# EAGLE design TNY-NROM-02 (EAGLE 9.6.2)
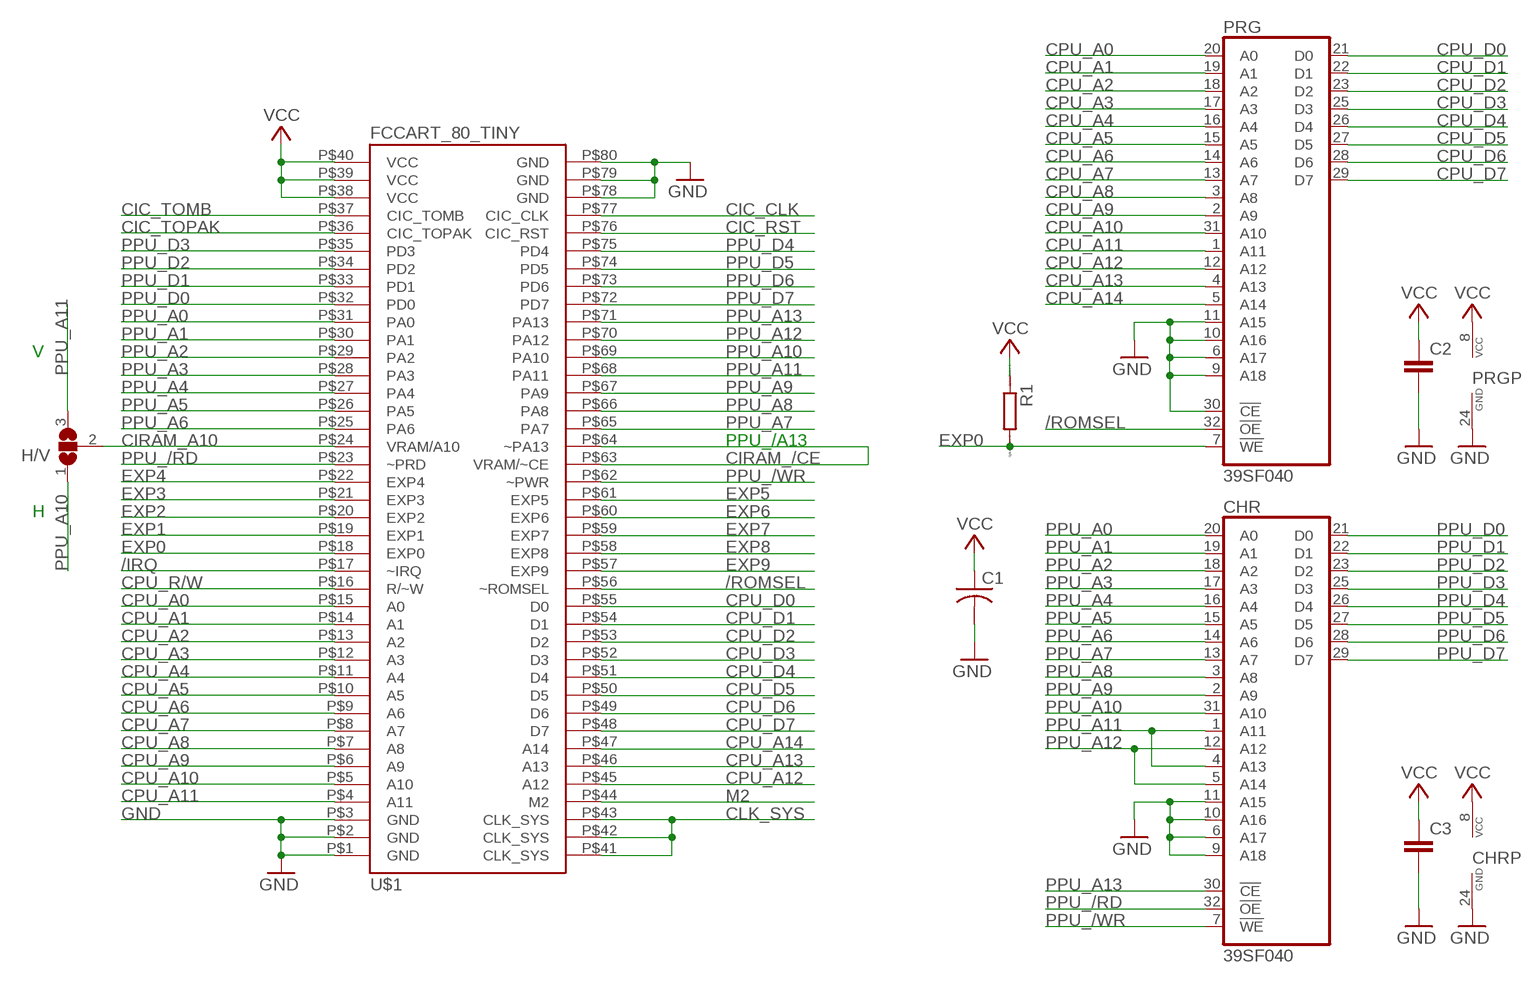
[diagram p0: schematic, sheet 1]

## Parts
C1  C-USC1206  [C1206]
C2  C-EUC0603K  [C0603K]
C3  C-EUC0603K  [C0603K]
CHR  39SF040  AM29F040ESHORT  [TSOP32_SHORT]
H/V  SJ2W  [SJ_2]
PRG  39SF040  AM29F040ESHORT  [TSOP32_SHORT]
R1  RR0603  [R0603]
U$1  FCCART_80_TINY  [FCCART_80_TINY]

## Nets
/IRQ: U$1.P$17(~IRQ)
/ROMSEL: PRG.32(!OE) U$1.P$56(~ROMSEL)
CIC_CLK: U$1.P$77(CIC_CLK)
CIC_RST: U$1.P$76(CIC_RST)
CIC_TOMB: U$1.P$37(CIC_TOMB)
CIC_TOPAK: U$1.P$36(CIC_TOPAK)
CIRAM_/CE: U$1.P$63(VRAM/~CE) U$1.P$64(~PA13)
CIRAM_A10: H/V.2 U$1.P$24(VRAM/A10)
CLK_SYS: U$1.P$41(CLK_SYS) U$1.P$42(CLK_SYS) U$1.P$43(CLK_SYS)
CPU_A0: PRG.20(A0) U$1.P$15(A0)
CPU_A1: PRG.19(A1) U$1.P$14(A1)
CPU_A2: PRG.18(A2) U$1.P$13(A2)
CPU_A3: PRG.17(A3) U$1.P$12(A3)
CPU_A4: PRG.16(A4) U$1.P$11(A4)
CPU_A5: PRG.15(A5) U$1.P$10(A5)
CPU_A6: PRG.14(A6) U$1.P$9(A6)
CPU_A7: PRG.13(A7) U$1.P$8(A7)
CPU_A8: PRG.3(A8) U$1.P$7(A8)
CPU_A9: PRG.2(A9) U$1.P$6(A9)
CPU_A10: PRG.31(A10) U$1.P$5(A10)
CPU_A11: PRG.1(A11) U$1.P$4(A11)
CPU_A12: PRG.12(A12) U$1.P$45(A12)
CPU_A13: PRG.4(A13) U$1.P$46(A13)
CPU_A14: PRG.5(A14) U$1.P$47(A14)
CPU_D0: PRG.21(D0) U$1.P$55(D0)
CPU_D1: PRG.22(D1) U$1.P$54(D1)
CPU_D2: PRG.23(D2) U$1.P$53(D2)
CPU_D3: PRG.25(D3) U$1.P$52(D3)
CPU_D4: PRG.26(D4) U$1.P$51(D4)
CPU_D5: PRG.27(D5) U$1.P$50(D5)
CPU_D6: PRG.28(D6) U$1.P$49(D6)
CPU_D7: PRG.29(D7) U$1.P$48(D7)
CPU_R/W: U$1.P$16(R/~W)
EXP0: PRG.7(!WE) R1.2 U$1.P$18(EXP0)
EXP1: U$1.P$19(EXP1)
EXP2: U$1.P$20(EXP2)
EXP3: U$1.P$21(EXP3)
EXP4: U$1.P$22(EXP4)
EXP5: U$1.P$61(EXP5)
EXP6: U$1.P$60(EXP6)
EXP7: U$1.P$59(EXP7)
EXP8: U$1.P$58(EXP8)
EXP9: U$1.P$57(EXP9)
GND: C1.2 C2.2 C3.2 CHR.6(A17) CHR.9(A18) CHR.10(A16) CHR.11(A15) CHR.24(GND) PRG.6(A17) PRG.9(A18) PRG.10(A16) PRG.11(A15) PRG.24(GND) PRG.30(!CE) U$1.P$1(GND) U$1.P$2(GND) U$1.P$3(GND) U$1.P$78(GND) U$1.P$79(GND) U$1.P$80(GND)
M2: U$1.P$44(M2)
PPU_/RD: CHR.32(!OE) U$1.P$23(~PRD)
PPU_/WR: CHR.7(!WE) U$1.P$62(~PWR)
PPU_A0: CHR.20(A0) U$1.P$31(PA0)
PPU_A1: CHR.19(A1) U$1.P$30(PA1)
PPU_A2: CHR.18(A2) U$1.P$29(PA2)
PPU_A3: CHR.17(A3) U$1.P$28(PA3)
PPU_A4: CHR.16(A4) U$1.P$27(PA4)
PPU_A5: CHR.15(A5) U$1.P$26(PA5)
PPU_A6: CHR.14(A6) U$1.P$25(PA6)
PPU_A7: CHR.13(A7) U$1.P$65(PA7)
PPU_A8: CHR.3(A8) U$1.P$66(PA8)
PPU_A9: CHR.2(A9) U$1.P$67(PA9)
PPU_A10: CHR.31(A10) H/V.1 U$1.P$69(PA10)
PPU_A11: CHR.1(A11) CHR.4(A13) H/V.3 U$1.P$68(PA11)
PPU_A12: CHR.5(A14) CHR.12(A12) U$1.P$70(PA12)
PPU_A13: CHR.30(!CE) U$1.P$71(PA13)
PPU_D0: CHR.21(D0) U$1.P$32(PD0)
PPU_D1: CHR.22(D1) U$1.P$33(PD1)
PPU_D2: CHR.23(D2) U$1.P$34(PD2)
PPU_D3: CHR.25(D3) U$1.P$35(PD3)
PPU_D4: CHR.26(D4) U$1.P$75(PD4)
PPU_D5: CHR.27(D5) U$1.P$74(PD5)
PPU_D6: CHR.28(D6) U$1.P$73(PD6)
PPU_D7: CHR.29(D7) U$1.P$72(PD7)
VCC: C1.1 C2.1 C3.1 CHR.8(VCC) PRG.8(VCC) R1.1 U$1.P$38(VCC) U$1.P$39(VCC) U$1.P$40(VCC)

## Notes on the sheet
- V
- PPU_/A13
- H

## Library data of the parts
C1 = rcl:C-US: CAPACITOR, American symbol
C2 C3 = rcl:C-EU: CAPACITOR, European symbol
CHR PRG = am29-memory:AM29F040E: 4-Megabit FLASH MEMORY (512 K x 8 bit) 5 V-only
H/V = jumper:SJ2W: SMD solder JUMPER
R1 = eagle-ltspice:R: RESISTOR, European symbol; SPICEMODEL: NONE; SPICEPREFIX: R
U$1 = FC_connector_2:FCCART_80_TINY

## Board
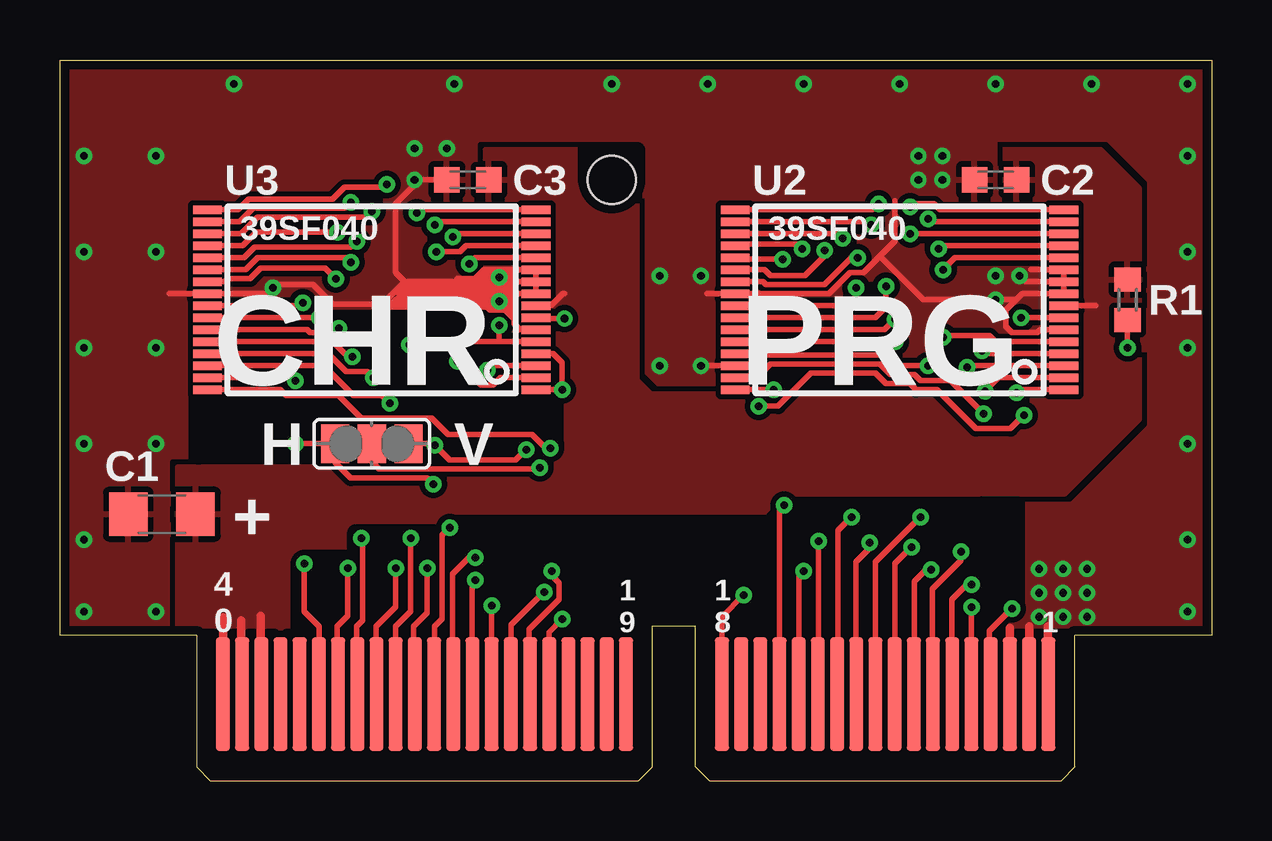
[diagram p1: board, top side]
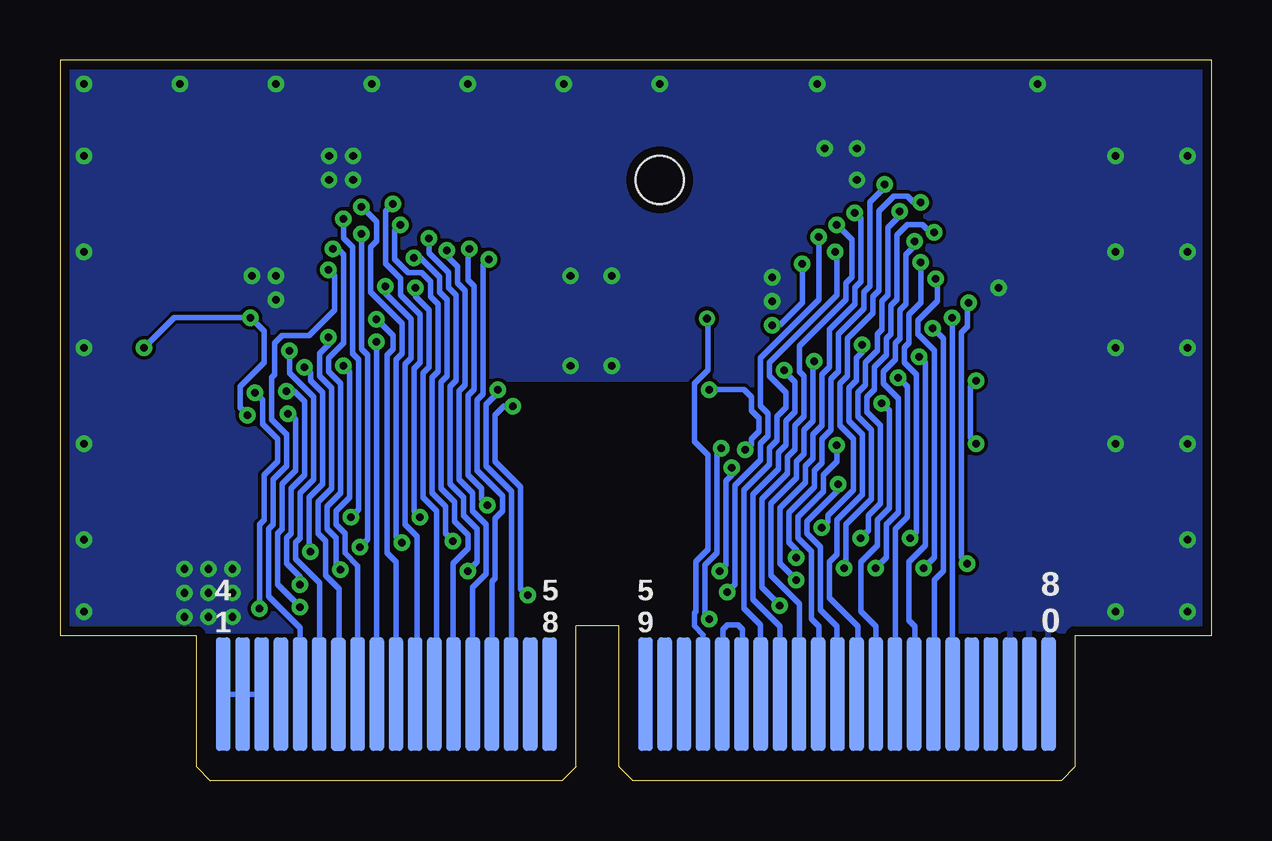
[diagram p2: board, bottom side, seen from below]

Size 48 x 30.05 mm. Coordinates in mm from the lower left corner, seen from the top.
Copper layers (1*16): Top 0.0356mm / dielectric 1.5011mm / Bottom 0.0356mm
Design rules "jlcpcb *": minimum track width 6mil, minimum drill 13mil, track to track 6mil, track to pad 5mil, pad to pad 5mil, via to via 6mil, smd to smd 5mil, copper to edge 15mil, drill to drill 22mil, minimum pad ring 7mil, minimum via ring 7mil, stop-mask expansion 2.5mil, vias tented up to drill 13mil, thermal gap 10mil
Holes 2 mm at 23,25.05
tRestrict: area 20,14.1 to 20.7,16.1; area 21.9,24.9 to 24.1,26.3; area 11.4,18.7 to 17.8,20.5; area 5.7,13.5 to 5.9,16.1; area 38.4,7.1 to 39.9,11.5; area 16.2,10.5 to 29.6,10.8; area 10.2,8.6 to 15.8,10.4; area 9.9,6.1 to 10.6,9
bRestrict: area 20,15.1 to 30.1,16.5

### Footprints (pad centres in the part's own frame; a part is rotated, then mirrored left to right if it is on the bottom)
C1206 = smd 1.6 x 1.8: 1 -1.4,0; 2 1.4,0
C0603K = smd 1.05 x 1.08: 1 -0.875,0; 2 0.875,0
TSOP32_SHORT = smd 0.36 x 1.2: 1 -3.75,-9.85; 2 -3.25,-9.85; 3 -2.75,-9.85; 4 -2.25,-9.85; 5 -1.75,-9.85; 6 -1.25,-9.85; 7 -0.75,-9.85; 8 -0.25,-9.85; 9 0.25,-9.85; 10 0.75,-9.85; 11 1.25,-9.85; 12 1.75,-9.85; 13 2.25,-9.85; 14 2.75,-9.85; 15 3.25,-9.85; 16 3.75,-9.85; 17 3.75,3.85; 18 3.25,3.85; 19 2.75,3.85; 20 2.25,3.85; 21 1.75,3.85; 22 1.25,3.85; 23 0.75,3.85; 24 0.25,3.85; 25 -0.25,3.85; 26 -0.75,3.85; 27 -1.25,3.85; 28 -1.75,3.85; 29 -2.25,3.85; 30 -2.75,3.85; 31 -3.25,3.85; 32 -3.75,3.85
SJ_2 = smd 1.168 x 1.6: 1 -1.524,0; 2 0,0; 3 1.524,0
R0603 = smd 1 x 1.1: 1 -0.85,0; 2 0.85,0
FCCART_80_TINY = smd 0.6 x 4.75: P$1 35.871,3.71; P$2 35.068,3.71; P$3 34.268,3.71; P$4 33.468,3.71; P$5 32.668,3.71; P$6 31.868,3.71; P$7 31.063,3.71; P$8 30.268,3.71; P$9 29.468,3.71; P$10 28.668,3.71; P$11 27.868,3.71; P$12 27.068,3.71; P$13 26.263,3.71; P$14 25.468,3.71; P$15 24.663,3.71; P$16 23.868,3.71; P$17 23.068,3.71; P$18 22.268,3.71; P$19 18.268,3.71; P$20 17.468,3.71; P$21 16.668,3.71; P$22 15.868,3.71; P$23 15.068,3.71; P$24 14.268,3.71; P$25 13.468,3.71; P$26 12.668,3.71; P$27 11.868,3.71; P$28 11.068,3.71; P$29 10.268,3.71; P$30 9.468,3.71; P$31 8.668,3.71; P$32 7.868,3.71; P$33 7.068,3.71; P$34 6.268,3.71; P$35 5.468,3.71; P$36 4.668,3.71; P$37 3.868,3.71; P$38 3.068,3.71; P$39 2.268,3.71; P$40 1.468,3.71 | smd 0.6 x 4.75 bottom: P$41 35.872,3.71; P$42 35.059,3.71; P$43 34.269,3.71; P$44 33.469,3.71; P$45 32.669,3.71; P$46 31.869,3.71; P$47 31.074,3.7; P$48 30.269,3.71; P$49 29.469,3.71; P$50 28.669,3.71; P$51 27.869,3.71; P$52 27.069,3.71; P$53 26.274,3.71; P$54 25.469,3.71; P$55 24.674,3.71; P$56 23.869,3.71; P$57 23.069,3.71; P$58 22.269,3.71; P$59 18.269,3.71; P$60 17.469,3.71; P$61 16.669,3.71; P$62 15.869,3.71; P$63 15.069,3.71; P$64 14.269,3.71; P$65 13.469,3.71; P$66 12.669,3.71; P$67 11.869,3.71; P$68 11.069,3.71; P$69 10.269,3.71; P$70 9.469,3.71; P$71 8.669,3.71; P$72 7.869,3.71; P$73 7.069,3.71; P$74 6.269,3.71; P$75 5.469,3.71; P$76 4.669,3.71; P$77 3.869,3.71; P$78 3.069,3.71; P$79 2.269,3.72; P$80 1.469,3.71

### Placement (x,y rotation side)
C1  4.25,11.11 180 top
C2  39,25.05 180 top
C3  17,25.05 180 top
CHR  10,20.05 90 top
H/V  13,14.05 0 top
PRG  32,20.05 90 top
R1  44.5,20.05 270 top
U$1  5.32,-0.1 0 top

### Tracks (layer width: path | path; a pad name or v marks a point on that pad's centre or on a via)
/ROMSEL  (via drill 0.33)
  Top 0.22: v29.75,16.3 PRG.32
  Bottom 0.22: U$1.P$56 29.19,12.05 30.25,13.11 30.25,15.68 29.75,16.18 v29.75,16.3
CIRAM_/CE
  Bottom 0.22: U$1.P$63 20.37,3.63 20.37,6.3 20.19,6.49 19.75,6.49 19.56,6.3 19.56,3.64 U$1.P$64
CIRAM_A10  (via drill 0.33)
  Top 0.22: H/V.2 13,13.3 13.31,12.99 19.94,12.99 v20,13.05 | U$1.P$24 19.56,3.64 19.56,6.3 20.81,7.55 20.81,8.24 20.5,8.55 v20.5,8.74
  Bottom 0.22: v20.5,8.74 20.25,8.99 20.25,12.49 20,12.74 v20,13.05
CLK_SYS
  Bottom 0.22: U$1.P$43 U$1.P$42 U$1.P$41
CPU_A0  (via drill 0.33)
  Top 0.22: U$1.P$15 30,11.3 v30.19,11.49 | v30.94,22.18 30.75,22.36 28.21,22.36 arc90 PRG.20
  Bottom 0.22: v30.19,11.49 30.44,11.74 30.44,12.18 31,12.74 31,16.05 30.75,16.3 30.75,20.61 31,20.86 31,21.99 30.94,22.05 v30.94,22.18
CPU_A1  (via drill 0.33)
  Top 0.22: 30.81,3.63 U$1.P$14 30.79,8.53 v31,8.74 | v32.62,22.61 32.44,22.8 PRG.19
  Bottom 0.22: v31,8.74 30.62,9.11 30.62,10.49 31.19,11.05 31.19,11.8 31.75,12.36 31.75,16.43 31.5,16.68 31.5,20.24 31.81,20.55 31.81,21.18 32.62,21.99 v32.62,22.61
CPU_A2  (via drill 0.33)
  Top 0.22: U$1.P$13 31.62,3.65 v31.62,9.99 | v33.81,23.18 33.69,23.3 PRG.18
  Bottom 0.22: v31.62,9.99 31.94,10.3 31.94,11.43 32.5,11.99 32.5,16.8 32.25,17.05 32.25,19.86 32.56,20.18 32.56,20.8 32.94,21.18 33.5,21.18 34.06,21.74 34.06,22.93 v33.81,23.18
CPU_A3  (via drill 0.33)
  Top 0.22: U$1.P$12 32.44,3.65 32.44,10.43 v33,10.99 | v34.12,24.05 33.87,23.8 PRG.17
  Bottom 0.22: v33,10.99 33.25,11.24 33.25,17.18 33,17.43 33,19.43 33.81,20.24 33.81,20.93 34.44,21.55 34.44,23.74 v34.12,24.05
CPU_A4  (via drill 0.33)
  Top 0.22: U$1.P$11 33.19,9.11 33.75,9.68 v33.75,9.93 | v35.44,23.93 35.56,24.05 36.44,24.05 36.69,23.8 PRG.16
  Bottom 0.22: v33.75,9.93 34,10.18 34,17.55 33.75,17.8 33.75,19.05 35.06,20.36 35.06,22.24 34.81,22.49 34.81,23.3 v35.44,23.93
CPU_A5  (via drill 0.33)
  Top 0.22: U$1.P$10 34,9.11 v35.87,10.99 | v36.19,23.43 36.31,23.3 PRG.15
  Bottom 0.22: v35.87,10.99 35.56,11.3 35.56,17.55 35.81,17.8 35.81,22.24 36.19,22.61 v36.19,23.43
CPU_A6  (via drill 0.33)
  Top 0.22: U$1.P$9 34.81,3.63 34.81,9.05 v35.5,9.74 | v35.44,22.8 PRG.14
  Bottom 0.22: v35.5,9.74 35.19,10.05 35.19,17.74 35.44,17.99 v35.44,22.8
CPU_A7  (via drill 0.33)
  Top 0.22: U$1.P$8 35.62,3.64 35.62,8.3 36.12,8.8 v36.31,8.8 | v36.62,22.18 36.75,22.3 PRG.13
  Bottom 0.22: v36.31,8.8 36.5,8.99 36.5,10.11 36.87,10.49 36.87,11.43 36.31,11.99 36.31,16.55 36.81,17.05 36.81,17.61 36.19,18.24 36.19,21.93 36.44,22.18 v36.62,22.18
CPU_A8  (via drill 0.33)
  Top 0.22: U$1.P$7 36.37,3.62 36.37,7.99 37.56,9.18 v37.56,9.55 | v37.81,17.24 37.87,17.3 PRG.3
  Bottom 0.22: v37.56,9.55 37.62,9.61 37.62,11.8 37.06,12.36 37.06,16.18 37.56,16.68 37.56,16.99 v37.81,17.24
CPU_A9  (via drill 0.33)
  Top 0.22: U$1.P$6 37.19,7.55 37.81,8.18 v38,8.18 | v38.56,16.24 39.12,16.8 PRG.2
  Bottom 0.22: v38.56,16.24 38.25,16.24 37.81,15.8 37.81,12.74 38.37,12.18 38.37,10.3 38.56,10.11 38.56,9.05 38,8.49 v38,8.18
CPU_A10  (via drill 0.33)
  Top 0.22: PRG.31 29.06,16.8 29.62,17.36 34.19,17.36 34.62,16.93 35.62,16.93 35.87,16.68 37.12,16.68 v38.5,15.3 | U$1.P$5 v38,7.24
  Bottom 0.22: v38,7.24 38.94,8.18 38.94,10.3 38.75,10.49 38.75,12.36 38.19,12.93 38.19,15.05 38.44,15.3 v38.5,15.3
CPU_A11  (via drill 0.33)
  Top 0.22: U$1.P$4 38.75,3.65 38.75,6.24 v39.69,7.18 | v39.87,16.18 40,16.3 PRG.1
  Bottom 0.22: v39.69,7.18 39.69,10.68 39.5,10.86 39.5,12.74 38.94,13.3 38.94,14.24 39.56,14.86 39.56,15.86 v39.87,16.18
CPU_A12  (via drill 0.33)
  Top 0.22: v36.81,21.3 37.31,21.8 PRG.12
  Bottom 0.22: U$1.P$45 38,6.36 39.31,7.68 39.31,10.49 39.12,10.68 39.12,12.55 38.56,13.11 38.56,14.43 39.19,15.05 39.19,16.8 39.06,16.93 39.06,18.24 38.75,18.55 37.62,18.55 36.56,19.61 36.56,21.05 v36.81,21.3
CPU_A13  (via drill 0.33)
  Top 0.22: v38.44,17.93 38.56,17.8 PRG.4
  Bottom 0.22: U$1.P$46 37.19,8.24 38.19,9.24 38.19,9.93 38,10.11 38,11.99 37.44,12.55 37.44,15.99 38.44,16.99 v38.44,17.93
CPU_A14  (via drill 0.33)
  Top 0.22: v36.81,18.49 36.87,18.55 38.75,18.55 39,18.3 PRG.5
  Bottom 0.22: U$1.P$47 36.37,3.62 36.37,7.99 36.94,8.55 36.94,9.99 37.25,10.3 37.25,11.61 36.69,12.18 36.69,16.36 37.19,16.86 37.19,17.8 36.81,18.18 v36.81,18.49
CPU_D0  (via drill 0.33)
  Top 0.22: PRG.21 28.21,21.74 v30.12,21.74
  Bottom 0.22: v30.12,21.74 30.37,21.49 30.37,16.11 30.62,15.86 30.62,12.93 29.56,11.86 29.56,11.24 29.87,10.93 29.87,8.43 30,8.3 U$1.P$55
CPU_D1  (via drill 0.33)
  Top 0.22: v31.87,22.11 31.87,21.86 31.06,21.05 29.62,21.05 29.37,21.3 PRG.22
  Bottom 0.22: U$1.P$54 30.81,3.63 30.81,8.05 30.25,8.61 30.25,10.68 30.81,11.24 30.81,11.99 31.37,12.55 31.37,16.24 31.12,16.49 31.12,20.43 31.44,20.74 31.44,21.43 31.87,21.86 v31.87,22.11
CPU_D2  (via drill 0.33)
  Top 0.22: v33.25,21.8 33,21.8 31.87,20.68 29.44,20.68 29.31,20.8 PRG.23
  Bottom 0.22: U$1.P$53 31.62,3.64 31.62,9.05 31,9.68 31,10.24 31.56,10.8 31.56,11.61 32.12,12.18 32.12,16.61 31.87,16.86 31.87,20.05 32.19,20.36 32.19,20.99 33,21.8 v33.25,21.8
CPU_D3  (via drill 0.33)
  Top 0.22: v33.19,20.55 33.19,20.18 32.81,19.8 PRG.25
  Bottom 0.22: U$1.P$52 32.31,3.78 32.31,11.24 32.87,11.8 32.87,16.99 32.62,17.24 32.62,19.61 33.19,20.18 v33.19,20.55
CPU_D4  (via drill 0.33)
  Top 0.22: PRG.26 34,19.3 34.44,19.74 v34.44,20.61
  Bottom 0.22: U$1.P$51 33.12,3.68 33.12,10.18 33.62,10.68 33.62,17.36 33.37,17.61 33.37,19.24 34.44,20.3 v34.44,20.61
CPU_D5  (via drill 0.33)
  Top 0.22: v34.81,19.24 34.37,18.8 PRG.27
  Bottom 0.22: U$1.P$50 34,9.11 34.37,9.49 34.37,17.74 34.12,17.99 34.12,18.55 v34.81,19.24
CPU_D6  (via drill 0.33)
  Top 0.22: v34.81,18.3 PRG.28
  Bottom 0.22: U$1.P$49 34.79,18.03 v34.81,18.3
CPU_D7  (via drill 0.33)
  Top 0.22: PRG.29 28.21,17.74 34.37,17.74 34.81,17.3 v36.19,17.3
  Bottom 0.22: v36.19,17.3 35.94,17.05 35.94,11.8 36.5,11.24 36.5,10.68 36.12,10.3 36.12,9.49 35.59,8.96 U$1.P$48
EXP0  (via drill 0.33)
  Top 0.22: PRG.7 v40.06,19.3 | v40.19,15.24 39.62,14.68 38.19,14.68 36.56,16.3 35.69,16.3 35.44,16.55 34.44,16.55 34,16.99 31.31,16.99 29.94,15.61 v29.12,15.61 | v28.5,7.74 27.59,6.83 U$1.P$18 | 44.6,19.3 R1.2 v44.5,18.05
  Bottom 0.22: v40.19,15.24 40.5,15.55 40.5,16.43 39.5,17.43 39.5,18.74 v40.06,19.3 43.25,19.3 v44.5,18.05 | v29.12,15.61 29.5,15.61 29.87,15.24 29.87,13.3 28.81,12.24 28.81,7.99 28.56,7.74 v28.5,7.74
GND  (via drill 0.33)
  Top 0.22: CHR.10 CHR.11 18.94,21.3 | CHR.10 CHR.9 18.75,20.3 | 34.19,21.86 33.5,21.18 32.94,21.18 32.06,20.3 PRG.24 26.97,20.3 | 34.19,21.86 34.81,22.49 34.81,24.18 | PRG.30 v26.72,17.3 | PRG.6 40.87,18.8 40.75,18.68 39.69,18.68 39.44,18.93 39.44,19.61 39.87,20.05 | PRG.10 PRG.9 40.12,20.3 39.87,20.05 | PRG.10 PRG.11 40.47,21.3 | 39.87,20.05 36,20.05 34.19,21.86 | CHR.6 19.19,18.8 18.94,19.05 18.94,19.24 | 18.94,19.24 18.94,20.05 | 14.37,20.8 13.44,19.86 11.37,19.86 10.56,20.68 9,20.68 v8.87,20.55 8.62,20.3 CHR.24 4.56,20.3 | 14.37,20.8 17.37,20.8 | 17.37,20.8 CHR.10 | 14.37,20.8 14,21.18 14,24.05 15,25.05 C3.2 | 17.5,21.11 17.69,21.3 18.94,21.3 | 18.94,19.24 18.44,19.74 | 18.44,19.74 17.97,20.21 | 18.94,21.3 18.94,20.11 | 17.37,20.8 17.31,20.93 | 17.31,20.93 18.81,21.11 18.75,21.05 18.75,20.43 18.69,20.49 18.19,20.49 18,20.68 18.56,20.68 18.56,20.99 18.5,20.93 17.31,20.93 | 18.94,19.24 18.81,20.18 18.56,20.18 18.69,20.05 18.69,19.99 | 17.31,20.93 16.56,20.93 | 17.31,20.93 17.5,21.11 | 17.5,21.11 18.5,21.11 | 17.37,20.8 17.56,20.61 | 17.56,20.61 17.87,20.61 18.19,20.3 18.19,20.24 18.25,20.3 18.75,20.3 | 18.75,20.3 18.5,20.05 18.31,20.05 18.25,20.11 18.31,20.18 18.5,20.18 18.62,20.05 18.62,19.8 18.56,19.86 18.5,19.86 18.75,19.61 18.81,19.61 18.75,19.68 18.75,19.86 | U$1.P$3 39.56,3.64 | U$1.P$2 40.37,3.63 | U$1.P$1 41.19,3.62 | PRG.10 40.25,20.8 | 17.56,20.61 17.97,20.21 | 17.97,20.21 17.94,19.61 | 18.25,19.61 18.59,19.61 18.47,19.74 18.44,19.74 | 18.44,19.74 18.12,19.74 | 18.12,19.74 18.12,19.86 18.19,19.93 18.47,19.93 18.62,19.77 18.62,19.68 | 17.56,20.61 17.53,20.58 14.25,20.58 14.06,20.39 | 14.03,20.36 14.06,20.39
  Top 0.22: 14.06,20.39 17.97,20.39 18.03,20.33 18.03,20.21 17.56,19.74 | 17.56,19.74 13.16,19.74 | 17.56,19.74 18.12,19.74 | 18.44,19.74 18.25,19.61 | 18.25,19.61 17.94,19.61 | 17.94,19.61 17.81,19.74 17.81,20.21 17.75,20.27 14.22,20.27 13.87,19.93 13.81,19.93 13.84,19.89 17.69,19.89 17.69,20.11 17.66,20.08 14.19,20.08
  Top 0.35: 39.56,3.64 39.62,3.7 39.59,3.74 39.59,6.36 | 40.37,3.63 40.41,3.66 40.41,6.43 | 41.19,3.62 41.19,6.43
  other vias: 35.78,25.05 40.81,6.83 40.81,7.83 41.81,7.83 41.81,6.83 47,7.05 47,29.05 47,18.05 47,22.05 47,26.05 47,14.05 47,10.05 1,7.05 1,18.05 1,22.05 1,26.05 1,14.05 1,10.05 40.81,8.83 41.81,8.83 42.81,8.83 42.81,7.83 42.81,6.83 4,7.05 4,14.05 4,18.05 4,22.05 4,26.05 43,29.05 39,29.05 35,29.05 31,29.05 27,29.05 23,29.05 16.44,29.05 7.25,29.05 25,17.3 25,21.05 26.72,21.05 40,21.05 39,21.05 39,20.05 36.78,26.05 35.78,26.05 36.78,25.05 18.31,20.99 18.31,19.99 16.12,26.36 14.78,25.05 14.78,26.36
  pour Bottom: 0,31.05 49,31.05 49,0.05 49,-0.95 -1,-0.95 -1,31.05
  pour Top (isolate 0.22, rank 6): -1,33.05 51,33.05 52,32.05 52,-4.95 -5,-4.95 -5,33.05
  pour Top (isolate 0.22): 42.12,21.77 42.12,17.8 41.37,18.55 34.34,18.55 34.31,18.52 28.47,18.52 28.53,18.58 28.53,21.27 31.06,23.8 31.06,24.8 35.16,27.89 38.97,26.89 38.97,23.58 40.78,21.77
PPU_/RD  (via drill 0.33)
  Top 0.22: CHR.32 9.19,16.3 9.44,16.05 11.62,16.05 12.56,15.11 15.5,15.11 16.19,14.43 19.69,14.43 20.25,13.86 v20.44,13.86 | v20.94,6.74 20.39,6.19 U$1.P$23
  Bottom 0.22: v20.44,13.86 20.62,13.68 20.62,9.49 21.12,8.99 21.12,6.93 v20.94,6.74
PPU_/WR  (via drill 0.33)
  Top 0.22: CHR.7 19.88,19.27 v21.03,19.27
  Bottom 0.22: v21.03,19.27 21,19.24 21,17.11 21.56,16.55 21.56,14.14 21,13.58 21,9.64 21.5,9.14 21.5,7.05 21.56,6.99 21.56,6.46 21.19,6.09 U$1.P$62
PPU_A0  (via drill 0.33)
  Top 0.22: U$1.P$31 14,6.43 14.62,7.05 v14.62,10.11 | v11.56,22.86 8.19,22.86 7.62,22.3 CHR.20
  Bottom 0.22: v14.62,10.11 14.31,10.43 14.31,11.05 13.81,11.55 13.81,14.8 14.37,15.36 14.37,15.99 14.06,16.3 14.06,17.24 13.56,17.74 13.56,18.43 13.37,18.61 13.37,19.8 13.12,20.05 13.12,22.74 12.69,23.18 12.06,23.18 11.75,22.86 v11.56,22.86
PPU_A1  (via drill 0.33)
  Top 0.22: U$1.P$30 14.75,3.65 14.75,6.43 15.31,6.99 v15.31,8.86 | v13,23.74 12.75,23.49 8.25,23.49 7.56,22.8 CHR.19
  Bottom 0.22: v15.31,8.86 15.25,8.86 15.25,10.68 14.19,11.74 14.19,14.61 14.75,15.18 14.75,16.18 14.44,16.49 14.44,17.43 13.94,17.93 13.94,18.61 13.75,18.8 13.75,19.99 13.5,20.24 13.5,23.05 13,23.55 v13,23.74
PPU_A2  (via drill 0.33)
  Top 0.22: U$1.P$29 15.62,3.64 15.62,6.43 15.94,6.74 15.94,10.24 v16.25,10.55 | v12.12,24.11 11.87,23.86 8.06,23.86 7.5,23.3 CHR.18
  Bottom 0.22: v16.25,10.55 16,10.8 16,11.05 14.94,12.11 14.94,14.24 15.5,14.8 15.5,16.55 15.19,16.86 15.19,18.43 14.12,19.49 14.12,20.18 13.87,20.43 13.87,23.74 13.25,24.36 12.69,24.36 12.44,24.11 v12.12,24.11
PPU_A3  (via drill 0.33)
  Top 0.22: U$1.P$28 16.37,3.63 16.37,8.61 17.06,9.3 v17.31,9.3 | CHR.17 7.44,23.8 7.87,24.24 11.37,24.24 11.87,24.74 13.5,24.74 v13.62,24.86
  Bottom 0.22: v17.31,9.3 17.31,9.61 17.62,9.93 17.62,11.18 16.56,12.24 16.56,12.93 16.25,13.24 16.25,14.24 15.87,14.61 15.87,16.74 15.56,17.05 15.56,18.61 14.5,19.68 14.5,20.36 14.25,20.61 14.25,24.11 13.62,24.74 v13.62,24.86
PPU_A4  (via drill 0.33)
  Top 0.22: U$1.P$27 17.19,8.3 v17.31,8.36 | v14.87,23.68 15,23.8 CHR.16
  Bottom 0.22: v17.31,8.36 18,9.05 18,11.36 16.94,12.43 16.94,13.11 16.62,13.43 16.62,14.43 16.25,14.8 16.25,16.93 15.94,17.24 15.94,18.8 14.87,19.86 14.87,20.55 14.62,20.8 14.62,23.43 v14.87,23.68
PPU_A5  (via drill 0.33)
  Top 0.22: U$1.P$26 v18,7.3 | v15.62,23.18 15.75,23.3 CHR.15
  Bottom 0.22: v18,7.3 18.75,8.05 18.75,11.74 17.69,12.8 17.69,13.49 17.37,13.8 17.37,14.8 17,15.18 17,16.86 17.19,17.05 17.19,18.11 15.25,20.05 15.25,20.74 15,20.99 15,22.55 v15.62,23.18
PPU_A6  (via drill 0.33)
  Top 0.22: U$1.P$25 18.81,3.63 18.81,6.49 v20.19,7.86 | v16.37,22.68 16.44,22.8 CHR.14
  Bottom 0.22: v20.19,7.86 19.87,8.18 19.87,12.3 18.81,13.36 18.81,14.05 18.5,14.36 18.5,15.3 18.81,15.61 18.81,17.61 16.37,20.05 v16.37,22.68
PPU_A7  (via drill 0.33)
  Top 0.22: v15.69,22.05 16.69,22.05 16.94,22.3 CHR.13
  Bottom 0.22: U$1.P$65 18.81,3.63 18.81,6.49 19.5,7.18 19.5,12.11 18.44,13.18 18.44,13.86 18.12,14.18 18.12,15.18 17.75,15.55 17.75,16.18 18.44,16.86 18.44,17.43 15.62,20.24 15.62,21.99 v15.69,22.05
PPU_A8  (via drill 0.33)
  Top 0.22: v17.81,17.11 17.87,17.3 CHR.3
  Bottom 0.22: U$1.P$66 18,6.43 19.12,7.55 19.12,11.93 18.06,12.99 18.06,13.68 17.75,13.99 17.75,14.99 17.37,15.36 17.37,16.61 17.81,17.05 v17.81,17.11
PPU_A9  (via drill 0.33)
  Top 0.22: v16.56,17.49 17.56,16.49 18.06,16.49 18.37,16.8 CHR.2
  Bottom 0.22: U$1.P$67 17.19,7.36 18.37,8.55 18.37,11.55 17.31,12.61 17.31,13.3 17,13.61 17,14.61 16.62,14.99 16.62,17.43 v16.56,17.49
PPU_A10  (via drill 0.33)
  Top 0.22: v15.56,12.36 15.31,12.61 12.12,12.61 11.48,13.26 H/V.1 v9.81,14.05 | v9.81,16.68 9.69,16.8 CHR.31
  Bottom 0.22: U$1.P$69 15.62,3.64 15.62,6.43 16.31,7.11 16.31,9.74 16.87,10.3 16.87,10.8 15.56,12.11 v15.56,12.36 | v9.81,14.05 10.06,14.3 10.06,16.43 v9.81,16.68
PPU_A11  (via drill 0.33)
  Top 0.22: 14.52,14.03 H/V.3 15.56,14.05 v15.62,13.99 16.25,13.36 19,13.36 v19.44,13.8 | CHR.1 v20.94,16.3 20.94,17.43 20.56,17.8 CHR.4
  Bottom 0.22: U$1.P$68 16.37,3.63 16.37,6.43 16.69,6.74 16.69,9.55 17.25,10.11 17.25,10.99 16.19,12.05 16.19,12.74 15.62,13.3 v15.62,13.99 | v19.44,13.8 19.19,13.99 19.19,14.24 18.87,14.55 18.87,15.11 19.19,15.43 19.19,15.99 19.5,16.3 v20.94,16.3
PPU_A12  (via drill 0.33)
  Top 0.22: v14.56,18.18 14.75,18.3 18.31,18.3 | 18.31,18.3 CHR.5 | CHR.12 17.31,21.8 v17.06,21.55 | v18.31,18.99 18.31,18.3
  Bottom 0.22: U$1.P$70 14.75,3.65 14.75,6.43 15.94,7.61 15.94,9.11 15.62,9.43 15.62,10.86 14.56,11.93 14.56,14.43 15.12,14.99 15.12,16.36 14.81,16.68 14.81,17.61 14.56,17.86 v14.56,18.18 | v17.06,21.55 17.06,19.93 18,18.99 v18.31,18.99
PPU_A13  (via drill 0.33)
  Top 0.22: v13.75,15.74 13.44,16.05 12.25,16.05 11,17.3 CHR.30
  Bottom 0.22: U$1.P$71 14,6.43 14.62,7.05 14.62,9.11 13.94,9.8 13.94,10.86 13.44,11.36 13.44,15.43 v13.75,15.74
PPU_D0  (via drill 0.33)
  Top 0.22: U$1.P$32 13.19,6.43 14,7.24 v14,8.86 | v12.37,22.49 12.12,22.24 8.12,22.24 7.69,21.8 CHR.21
  Bottom 0.22: v14,8.86 13.56,9.3 13.56,10.68 13.06,11.18 13.06,15.93 13.69,16.55 13.69,17.05 13.19,17.55 13.19,18.24 13,18.43 13,19.61 12.75,19.86 12.75,21.93 12.37,22.3 v12.37,22.49
PPU_D1  (via drill 0.33)
  Top 0.22: U$1.P$33 12.37,3.63 12.37,6.43 12.62,6.68 12.62,10.05 v12.56,10.11 | v12.12,21.61 12.06,21.8 8.25,21.8 7.75,21.3 CHR.22
  Bottom 0.22: v12.56,10.11 12.31,10.36 12.31,16.93 12.81,17.43 12.81,18.05 12.62,18.24 12.62,19.43 12.12,19.93 v12.12,21.61
PPU_D2  (via drill 0.33)
  Top 0.22: U$1.P$34 11.56,3.64 11.56,6.43 12,6.86 v12,8.86 | CHR.23 6.87,20.8 7,20.93 7.94,20.93 8.37,21.36 11.06,21.36 v11.5,20.93
  Bottom 0.22: v12,8.86 11.56,9.3 11.56,17.93 12.25,18.61 12.25,19.18 11.44,19.99 11.44,20.68 11.5,20.74 v11.5,20.93
PPU_D3  (via drill 0.33)
  Top 0.22: U$1.P$35 10.81,3.63 10.81,6.43 10.19,7.05 v10.19,9.05 | v10.12,19.93 10,19.8 CHR.25
  Bottom 0.22: v10.19,9.05 10.44,9.3 10.44,18.68 10.19,18.93 10.19,19.86 v10.12,19.93
PPU_D4  (via drill 0.33)
  Top 0.22: v10.81,19.3 CHR.26
  Bottom 0.22: U$1.P$75 10.81,3.63 v10.81,19.3
PPU_D5  (via drill 0.33)
  Top 0.22: v11.62,18.86 11.44,18.68 10.44,18.68 10.31,18.8 CHR.27
  Bottom 0.22: U$1.P$74 11.56,3.64 11.56,8.36 11.19,8.74 11.19,18.43 v11.62,18.86
PPU_D6  (via drill 0.33)
  Top 0.22: v12.19,17.68 12,17.68 11.37,18.3 CHR.28
  Bottom 0.22: U$1.P$73 12.37,3.63 12.37,6.43 12.62,6.68 12.62,9.11 11.94,9.8 11.94,17.43 v12.19,17.68
PPU_D7  (via drill 0.33)
  Top 0.22: v13.06,16.8 12.81,17.05 11.94,17.05 11.19,17.8 CHR.29
  Bottom 0.22: U$1.P$72 13.19,10.49 12.69,10.99 12.69,16.43 v13.06,16.8
VCC
  Top 0.22: PRG.8 43.19,19.8 | CHR.8 20.47,19.8 20.97,20.3 21.03,20.3
  Top 0.35: U$1.P$40 6.81,3.63 6.81,6.8 | U$1.P$39 7.56,3.64 7.56,6.68 | U$1.P$38 8.37,3.63 8.37,6.86
  pour Top (isolate 0.22, rank 3): 4.81,-1.29 4.91,-1.2 4.91,13.05 4.94,13.08 18,13.08 17.75,13.33 17.75,26.3 23.03,26.3 24.06,25.27 24.06,16.68 24.62,16.11 41.91,16.11 42.34,16.55 42.34,23.27 41.81,23.8 36.69,23.8 36.47,26.33 36.5,26.3 43.37,26.3 45,24.68 45,15.08 41.87,11.96 30.12,11.96 16.28,-1.89 4.78,-1.89 4.81,-1.86

### Text on the board
tNames: U3 | U2 | H | V | +
tStop: TNY-NROM-02